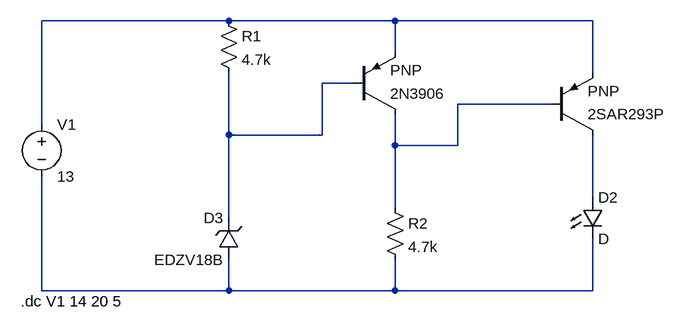
[diagram p0: schematic high side pnp circuit protection.asc]
high side pnp circuit protection.asc, the LTspice schematic file:
Version 4
SHEET 1 1096 680
WIRE 192 -304 -96 -304
WIRE 448 -304 192 -304
WIRE 752 -304 448 -304
WIRE 448 -256 448 -304
WIRE 752 -224 752 -304
WIRE 384 -208 336 -208
WIRE 688 -176 544 -176
WIRE -96 -144 -96 -304
WIRE 192 -128 192 -224
WIRE 336 -128 336 -208
WIRE 336 -128 192 -128
WIRE 448 -112 448 -160
WIRE 544 -112 544 -176
WIRE 544 -112 448 -112
WIRE 752 -32 752 -128
WIRE 448 -16 448 -112
WIRE 192 0 192 -128
WIRE -96 112 -96 -64
WIRE 192 112 192 64
WIRE 192 112 -96 112
WIRE 448 112 448 64
WIRE 448 112 192 112
WIRE 752 112 752 32
WIRE 752 112 448 112
SYMBOL voltage -96 -160 R0
SYMATTR InstName V1
SYMATTR Value 13
SYMBOL res 176 -320 R0
SYMATTR InstName R1
SYMATTR Value 4.7k
SYMBOL res 432 -32 R0
SYMATTR InstName R2
SYMATTR Value 4.7k
SYMBOL pnp 384 -160 M180
SYMATTR InstName 2N3906
SYMBOL pnp 688 -128 M180
SYMATTR InstName 2SAR293P
SYMBOL LED 736 -32 R0
SYMATTR InstName D2
SYMBOL zener 208 64 R180
WINDOW 0 24 64 Left 2
WINDOW 3 24 0 Left 2
SYMATTR InstName D3
SYMATTR Value EDZV18B
TEXT -128 128 Left 2 !.dc V1 14 20 5

The netlist it stands for:
* high side pnp circuit protection.asc
V1 N001 N005 13
R1 N001 N002 4.7k
R2 N003 N005 4.7k
Q§2N3906 N003 N002 N001 0 PNP
Q§2SAR293P N004 N003 N001 0 PNP
D2 N004 N005 D
D3 N005 N002 EDZV18B
.model D D
.lib standard.dio
.model NPN NPN
.model PNP PNP
.lib standard.bjt
.dc V1 14 20 5
.backanno
.end